# EAGLE design tricorder-pi-mk-1.0 (EAGLE 7.5.0)
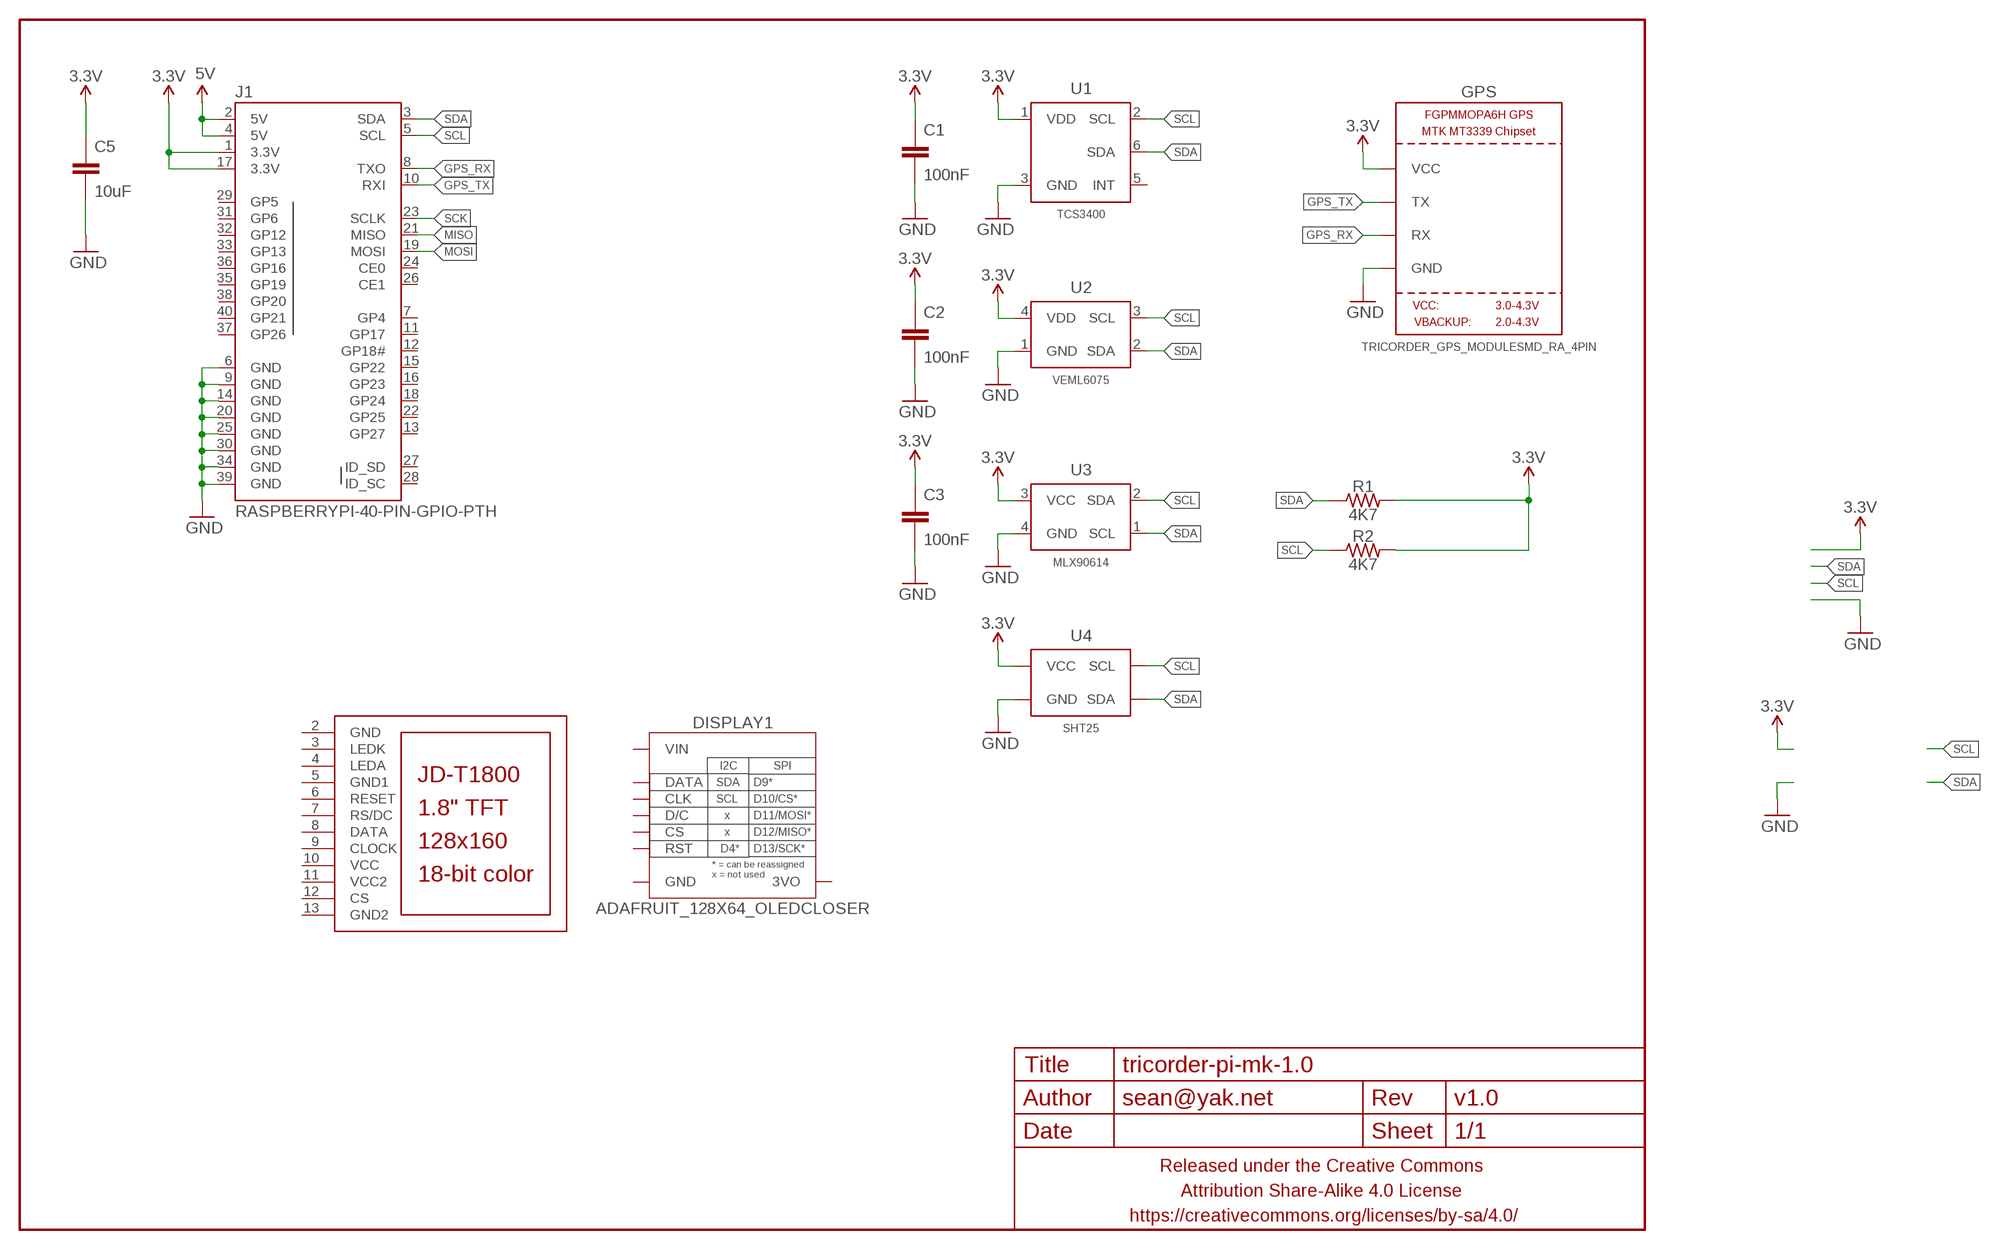
[diagram p0: schematic, sheet 1]

## Parts
C1  100nF  CAPACITOR-CERAMICC0603-TIGHTER  [C0603-TIGHTER]
C2  100nF  CAPACITOR-CERAMICC0603-TIGHTER  [C0603-TIGHTER]
C3  100nF  CAPACITOR-CERAMICC0603-TIGHTER  [C0603-TIGHTER]
C5  10uF  CAPACITOR-CERAMICC1210  [C1210]
DISPLAY1  ADAFRUIT_128X64_OLEDCLOSER  [ADAFRUIT_128X64_OLED_CLOSER]
FRAME1  FRAME-LETTERNO_PACKAGE  [DUMMY]
GPS  TRICORDER_GPS_MODULESMD_RA_4PIN  [TRICORDER_GPS_MODULE_RA_CONN_SMD_4PIN]
J1  RASPBERRYPI-40-PIN-GPIO-PTH  [2X20_PTH]
LCD1  JD-T1800  [JD-T1800]
R1  4K7  RESISTORR0603  [R0603]
R2  4K7  RESISTORR0603  [R0603]
U1  TCS3400  TCS3400DFN6  [TCS3400_DFN6]
U2  VEML6075  [OPLGA4]
U3  MLX90614  [TO-39-4]
U4  SHT25  [SHT25_DFN6]

## Nets
3.3V: C1.1 C2.1 C3.1 C5.1 GPS.VCC J1.1(3.3V) J1.17(3.3V) R1.2 R2.2 U1.1(VDD) U2.4(VDD) U3.3(VCC) U4.5(VCC)
5V: J1.2(5V) J1.4(5V)
GND: C1.2 C2.2 C3.2 C5.2 GPS.GND J1.6(GND) J1.9(GND) J1.14(GND) J1.20(GND) J1.25(GND) J1.30(GND) J1.34(GND) J1.39(GND) U1.3(GND) U2.1(GND) U3.4(GND) U4.2(GND)
GPS_RX: GPS.RX J1.8(TXO)
GPS_TX: GPS.TX J1.10(RXI)
MISO: J1.21(MISO)
MOSI: J1.19(MOSI)
SCK: J1.23(SCLK)
SCL: J1.5(SCL) R2.1 U1.2(SCL) U2.3(SCL) U3.2(SDA) U4.6(SCL)
SDA: J1.3(SDA) R1.1 U1.6(SDA) U2.2(SDA) U3.1(SCL) U4.1(SDA)
Unconnected: DISPLAY1.3VO DISPLAY1.CLK DISPLAY1.CS DISPLAY1.D/C DISPLAY1.DATA DISPLAY1.GND DISPLAY1.RST DISPLAY1.VIN J1.7(GP4) J1.11(GP17) J1.12(GP18#) J1.13(GP27) J1.15(GP22) J1.16(GP23) J1.18(GP24) J1.22(GP25) J1.24(CE0) J1.26(CE1) J1.27(ID_SD) J1.28(ID_SC) J1.29(GP5) J1.31(GP6) J1.32(GP12) J1.33(GP13) J1.35(GP19) J1.36(GP16) J1.37(GP26) J1.38(GP20) J1.40(GP21) LCD1.3(LEDK) LCD1.4(LEDA) LCD1.6(RESET) LCD1.7(RS/DC) LCD1.8(DATA) LCD1.9(CLOCK) LCD1.12(CS) U1.5(INT)

## Power pins joined to a net without a drawn wire
GND: LCD1.2(GND)
GND1: LCD1.5(GND1)
GND2: LCD1.13(GND2)
VCC: LCD1.10(VCC)
VCC2: LCD1.11(VCC2)

## Library data of the parts
C1-C3 C5 = a_parts:CAPACITOR-CERAMIC: CAPACITOR, European symbol
DISPLAY1 = a_parts:ADAFRUIT_128X64_OLED
FRAME1 = a_parts:FRAME-LETTER: Schematic Frame Standard 8.5x11 US Letter frame; DESIGNER: sean@yak.net; VERSION: v1.0
GPS = a_parts:TRICORDER_GPS_MODULE
J1 = a_parts:RASPBERRYPI-40-PIN-GPIO: Second Generation Raspberry Pi GPIO Header 2x20 pin connector, as found on B, B+, A+ models.
LCD1 = a_parts:JD-T1800
R1 R2 = a_parts:RESISTOR: RESISTOR, American symbol
U1 = a_parts:TCS3400
U2 = a_parts:VEML6075
U3 = a_parts:MLX90614
U4 = a_parts:SHT25

## Board
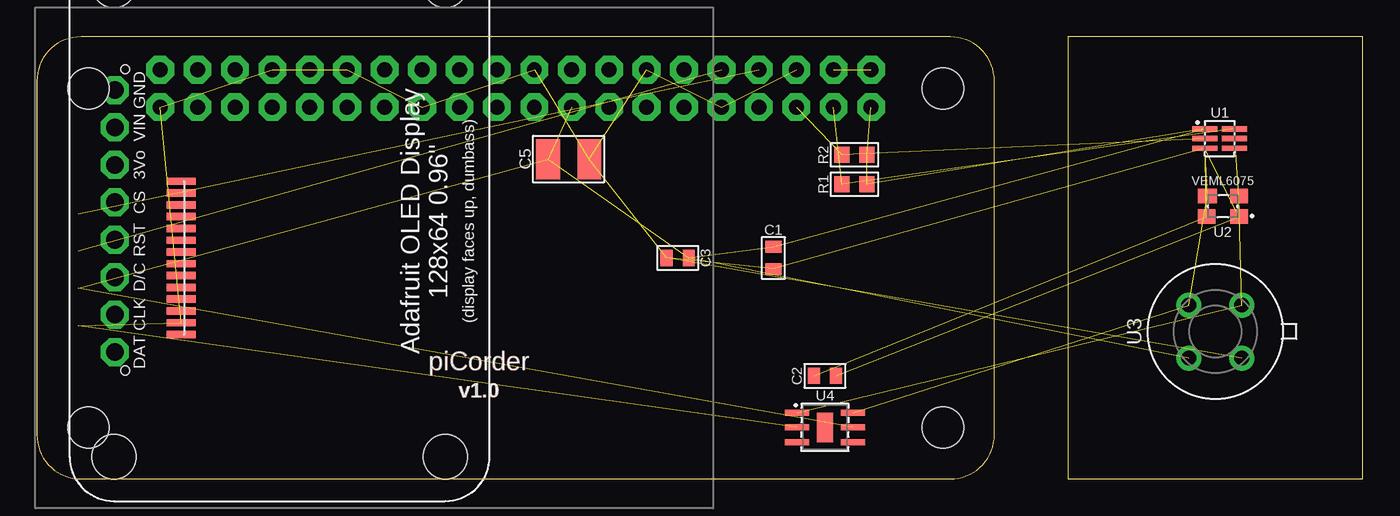
[diagram p1: board, top side]
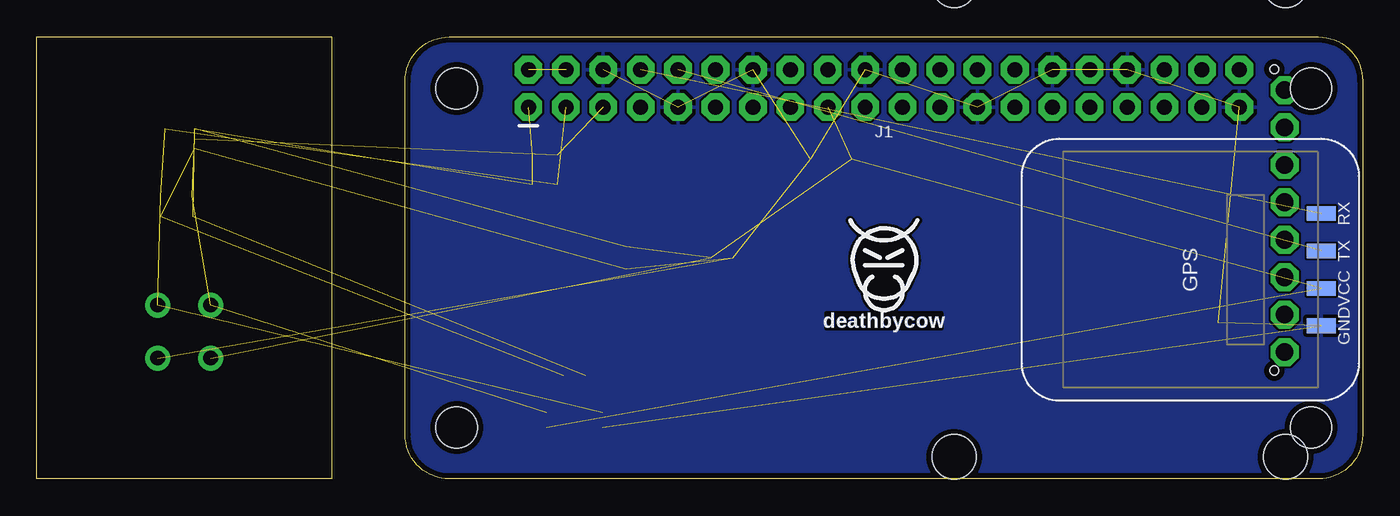
[diagram p2: board, bottom side, seen from below]

Size 90 x 30 mm. Coordinates in mm from the lower left corner, seen from the top.
Outline: 65,3 65,27 arc90 62,30 3,30 arc90 0,27 0,3 arc90 3,0 62,0 arc90 65,3
Outline: 70,30 70,0 90,0 90,30 70,30
Copper layers (1*16): Top 0.0356mm / dielectric 1.5011mm / Bottom 0.0356mm
Design rules "LaenPCBOrder2": minimum track width 6mil, minimum drill 13mil, track to track 6mil, track to pad 6mil, pad to pad 6mil, via to via 6mil, smd to smd 6mil, copper to edge 15mil, drill to drill 6mil, minimum pad ring 7mil, minimum via ring 7mil, stop-mask expansion 3mil, vias tented up to drill 20mil, thermal gap 10mil
Holes 2.8 mm at 3.5,3.5 3.5,26.5 61.5,3.5 61.5,26.5

### Footprints (pad centres in the part's own frame; a part is rotated, then mirrored left to right if it is on the bottom)
C0603-TIGHTER = smd 0.8 x 1.1: 1 -0.75,0; 2 0.75,0
C1210 = smd 1.6 x 2.7: 1 -1.4,0; 2 1.4,0
ADAFRUIT_128X64_OLED_CLOSER = drill 1.2 pad 1.9 octagon: 3VO 3.81,0; CLK -6.35,0; CS 1.27,0; D/C -3.81,0; DATA -8.89,0; GND 8.89,0; RST -1.27,0; VIN 6.35,0 | hole 3: -16,0.07; 16,0.07; -16,-22.43; 16,-22.43
TRICORDER_GPS_MODULE_RA_CONN_SMD_4PIN = smd 1 x 2: GND 3.81,8.89; RX -3.81,8.89; TX -1.27,8.89; VCC 1.27,8.89
2X20_PTH = drill 1.016 pad 1.88 octagon: 1 -24.13,-1.27; 2 -24.13,1.27; 3 -21.59,-1.27; 4 -21.59,1.27; 5 -19.05,-1.27; 6 -19.05,1.27; 7 -16.51,-1.27; 8 -16.51,1.27; 9 -13.97,-1.27; 10 -13.97,1.27; 11 -11.43,-1.27; 12 -11.43,1.27; 13 -8.89,-1.27; 14 -8.89,1.27; 15 -6.35,-1.27; 16 -6.35,1.27; 17 -3.81,-1.27; 18 -3.81,1.27; 19 -1.27,-1.27; 20 -1.27,1.27; 21 1.27,-1.27; 22 1.27,1.27; 23 3.81,-1.27; 24 3.81,1.27; 25 6.35,-1.27; 26 6.35,1.27; 27 8.89,-1.27; 28 8.89,1.27; 29 11.43,-1.27; 30 11.43,1.27; 31 13.97,-1.27; 32 13.97,1.27; 33 16.51,-1.27; 34 16.51,1.27; 35 19.05,-1.27; 36 19.05,1.27; 37 21.59,-1.27; 38 21.59,1.27; 39 24.13,-1.27; 40 24.13,1.27
JD-T1800 = smd 0.5 x 2: 1 5.2,-13.1; 2 4.4,-13.1; 3 3.6,-13.1; 4 2.8,-13.1; 5 2,-13.1; 6 1.2,-13.1; 7 0.4,-13.1; 8 -0.4,-13.1; 9 -1.2,-13.1; 10 -2,-13.1; 11 -2.8,-13.1; 12 -3.6,-13.1; 13 -4.4,-13.1; 14 -5.2,-13.1 | hole 0.6: -12.8,-16.9; 7.65,-16.9
R0603 = smd 1 x 1.1: 1 -0.85,0; 2 0.85,0
TCS3400_DFN6 = smd 1.7 x 0.35: 1 -1,0.65; 2 -1,0; 3 -1,-0.65; 4 1,-0.65; 5 1,0; 6 1,0.65
OPLGA4 = smd 1.2 x 1: 1 -1.1,0.7; 2 -1.1,-0.7; 4 1.1,0.7 | smd 1.3 x 1: 3 1.05,-0.7
TO-39-4 = drill 1 pad 1.7: 1 -1.8,1.8; 2 -1.8,-1.8; 3 1.8,-1.8; 4 1.8,1.8
SHT25_DFN6 = smd 1.6 x 0.4: 1 -1.9,1; 2 -1.9,0; 3 -1.9,-1; 4 1.9,-1; 5 1.9,0; 6 1.9,1 | smd 1.1 x 2: 7 0,0

### Placement (x,y rotation side)
C1  50,15 270 top
C2  53.5,7 0 top
C3  43.5,15 180 top
C5  36.1,21.7 0 top
DISPLAY1  5.3,17.5 90 top
FRAME1  0,0 0 top
GPS  11.7,14.2 270 bottom
J1  32.5,26.5 0 bottom
LCD1  22.9,15 270 top
R1  55.5,20 0 top
R2  55.5,22 0 top
U1  80.3,23.1 0 top
U2  80.5,18.5 180 top
U3  80,10 270 top
U4  53.5,3.5 0 top
U$2  [COW_SMALL_METAL]  32.5,15 0 bottom

### Tracks (layer width: path | path; a pad name or v marks a point on that pad's centre or on a via)
3.3V  (12 unrouted)
5V  (1 unrouted)
GND  (17 unrouted)
  pour Bottom: 0,0 0,30 65,30 65,0
GPS_RX  (1 unrouted)
GPS_TX  (1 unrouted)
SCL  (5 unrouted)
SDA  (5 unrouted)

### Text on the board
Top: piCorder
tPlace: piCorder